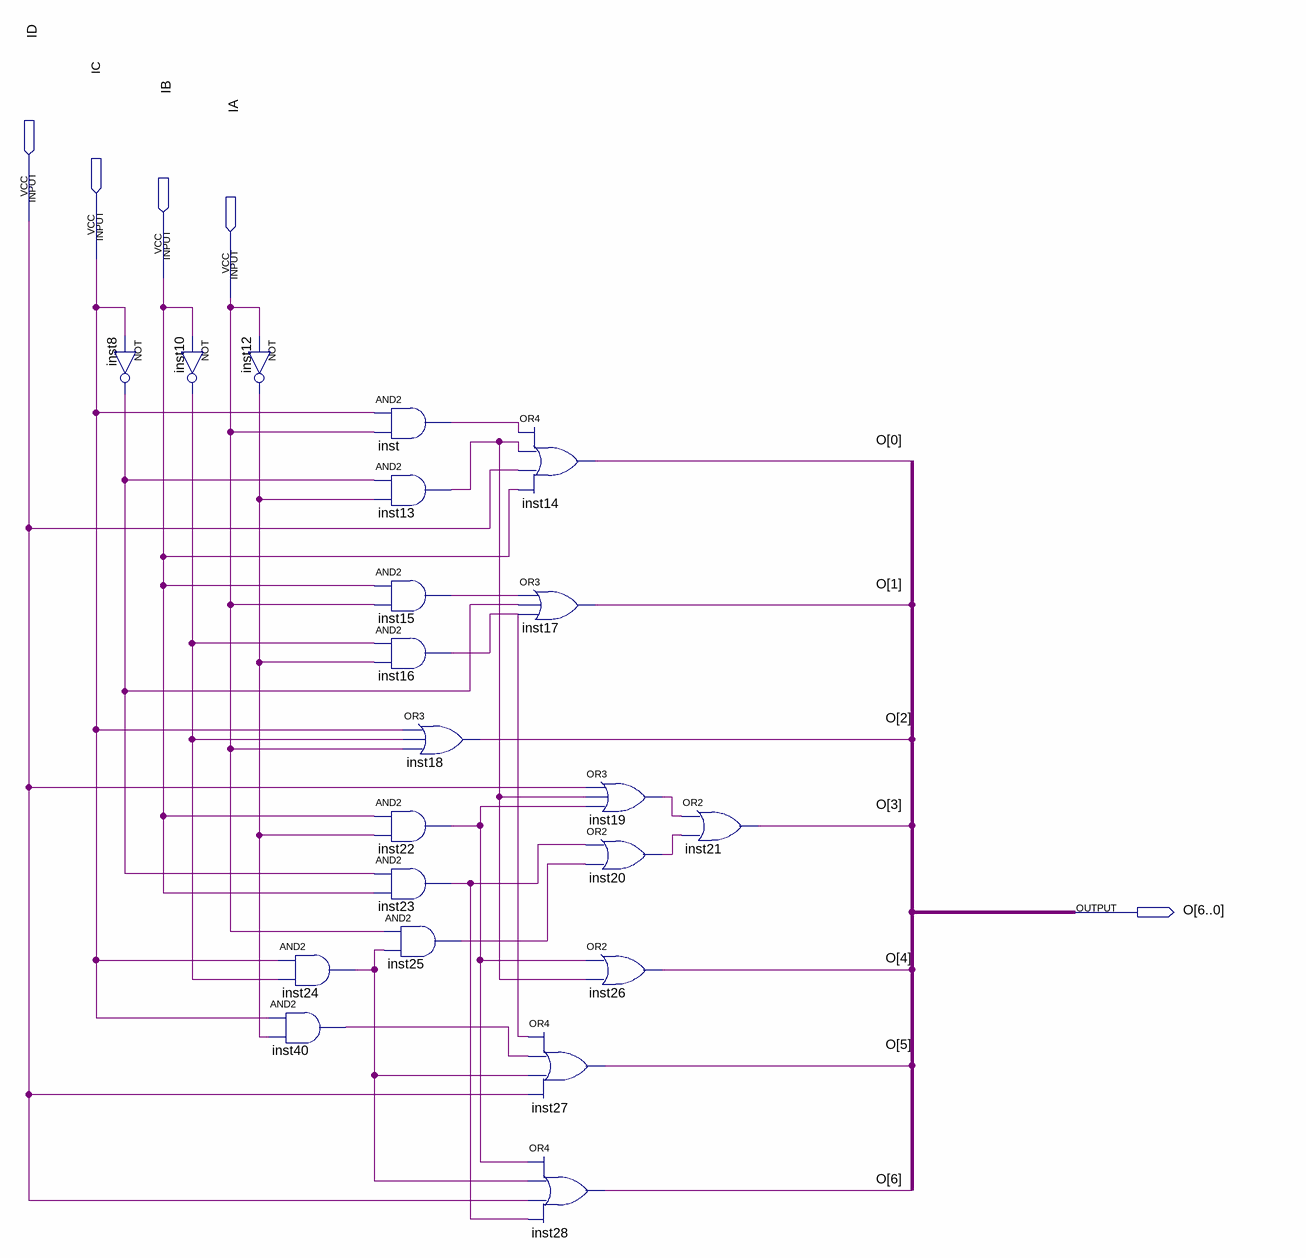
[diagram p0: schematic sheet]
// Quartus schematic seven_segment.bdf as structural Verilog: 21 symbols, 5 pins
module seven_segment (
  input  ID,
  input  IC,
  input  IB,
  input  IA,
  output [6:0] O
);

  wire inst8_out, inst10_out, inst12_out, inst13_out, inst15_out, inst16_out, inst19_out, inst20_out,
       inst22_out, inst23_out, inst24_out, inst25_out, inst40_out, inst_out;

  not inst8 (inst8_out, IC);
  not inst10 (inst10_out, IB);
  not inst12 (inst12_out, IA);
  and inst24 (inst24_out, IC, inst10_out);
  and inst40 (inst40_out, IC, inst12_out);
  and inst (inst_out, IC, IA);
  and inst13 (inst13_out, inst8_out, inst12_out);
  and inst15 (inst15_out, IB, IA);
  and inst16 (inst16_out, inst10_out, inst12_out);
  or inst18 (O[2], IC, inst10_out, IA);
  and inst22 (inst22_out, IB, inst12_out);
  and inst23 (inst23_out, inst8_out, IB);
  and inst25 (inst25_out, IA, inst24_out);
  or inst14 (O[0], inst_out, inst13_out, ID, IB);
  or inst17 (O[1], inst15_out, inst8_out, inst16_out);
  or inst27 (O[5], inst16_out, inst40_out, inst24_out, ID);
  or inst28 (O[6], inst22_out, inst24_out, ID, inst23_out);
  or inst19 (inst19_out, ID, inst13_out, inst22_out);
  or inst20 (inst20_out, inst23_out, inst25_out);
  or inst26 (O[4], inst22_out, inst13_out);
  or inst21 (O[3], inst19_out, inst20_out);
endmodule
